# Altium schematic sheet lcd_breakout.SchDoc
size A
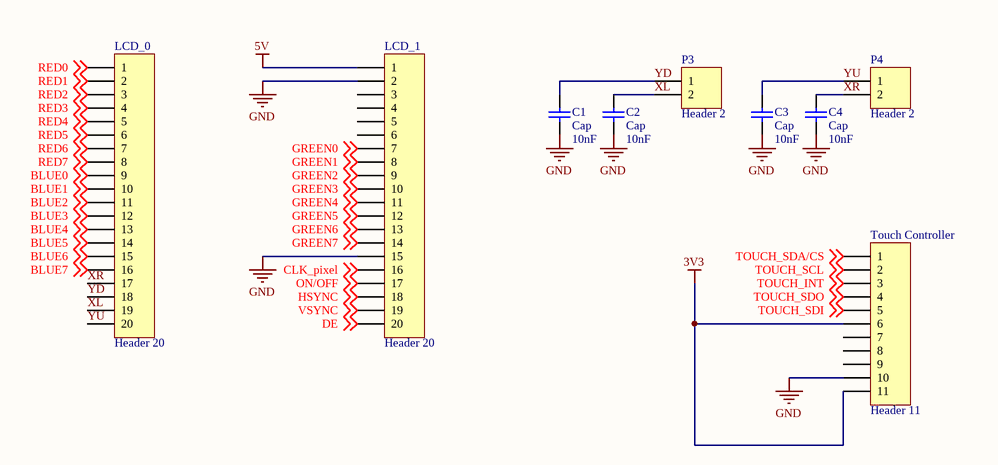
[diagram p0: lcd_breakout.SchDoc]

## Parts
C1  Cap  value 10nF  [6-0805_M]
C2  Cap  value 10nF  [6-0805_M]
C3  Cap  value 10nF  [6-0805_M]
C4  Cap  value 10nF  [6-0805_M]
LCD_0  Header 20  [HDR1X20]
LCD_1  Header 20  [HDR1X20]
P3  Header 2  [HDR1X2]
P4  Header 2  [HDR1X2]
Touch_Controller  Header 11  [HDR1X11]

## Nets
3V3: Touch_Controller.6 Touch_Controller.11
5V: LCD_1.1
GND: C1.1 C2.1 C3.1 C4.1 LCD_1.2 LCD_1.15 Touch_Controller.10
BLUE0: LCD_0.9 ; off-sheet BLUE0
BLUE1: LCD_0.10 ; off-sheet BLUE1
BLUE2: LCD_0.11 ; off-sheet BLUE2
BLUE3: LCD_0.12 ; off-sheet BLUE3
BLUE4: LCD_0.13 ; off-sheet BLUE4
BLUE5: LCD_0.14 ; off-sheet BLUE5
BLUE6: LCD_0.15 ; off-sheet BLUE6
BLUE7: LCD_0.16 ; off-sheet BLUE7
CLK_pixel: LCD_1.16 ; off-sheet CLK_pixel
DE: LCD_1.20 ; off-sheet DE
GREEN0: LCD_1.7 ; off-sheet GREEN0
GREEN1: LCD_1.8 ; off-sheet GREEN1
GREEN2: LCD_1.9 ; off-sheet GREEN2
GREEN3: LCD_1.10 ; off-sheet GREEN3
GREEN4: LCD_1.11 ; off-sheet GREEN4
GREEN5: LCD_1.12 ; off-sheet GREEN5
GREEN6: LCD_1.13 ; off-sheet GREEN6
GREEN7: LCD_1.14 ; off-sheet GREEN7
HSYNC: LCD_1.18 ; off-sheet HSYNC
ON/OFF: LCD_1.17 ; off-sheet ON/OFF
RED0: LCD_0.1 ; off-sheet RED0
RED1: LCD_0.2 ; off-sheet RED1
RED2: LCD_0.3 ; off-sheet RED2
RED3: LCD_0.4 ; off-sheet RED3
RED4: LCD_0.5 ; off-sheet RED4
RED5: LCD_0.6 ; off-sheet RED5
RED6: LCD_0.7 ; off-sheet RED6
RED7: LCD_0.8 ; off-sheet RED7
TOUCH_INT: Touch_Controller.3 ; off-sheet TOUCH_INT
TOUCH_SCL: Touch_Controller.2 ; off-sheet TOUCH_SCL
TOUCH_SDA/CS: Touch_Controller.1 ; off-sheet TOUCH_SDA/CS
TOUCH_SDI: Touch_Controller.5 ; off-sheet TOUCH_SDI
TOUCH_SDO: Touch_Controller.4 ; off-sheet TOUCH_SDO
VSYNC: LCD_1.19 ; off-sheet VSYNC
XL: C2.2 LCD_0.19 P3.2
XR: C4.2 LCD_0.17 P4.2
YD: C1.2 LCD_0.18 P3.1
YU: C3.2 LCD_0.20 P4.1

Not connected (* = marked no-connect by the designer): LCD_1 3 4 5 6; Touch_Controller 7 8 9

## Library data of the parts
C1-C4 = Cap: Capacitor; Published: 8-Jun-2000; LatestRevisionDate: 17-Jul-2002; LatestRevisionNote: Re-released for DXP Platform.; PackageReference: RAD-0.3; Publisher: Altium Limited; PackageDescription: Radial Cap, Thru-Hole; 2 Leads; 0.3 in Pin Spacing
LCD_0 LCD_1 = Header 20: Header, 20-Pin; LatestRevisionDate: 17-Jul-2002; LatestRevisionNote: Re-released for DXP Platform.; Publisher: Altium Limited
P3 P4 = Header 2: Header, 2-Pin; LatestRevisionDate: 17-Jul-2002; LatestRevisionNote: Re-released for DXP Platform.; Publisher: Altium Limited
Touch_Controller = Header 11: Header, 11-Pin; LatestRevisionDate: 17-Jul-2002; LatestRevisionNote: Re-released for DXP Platform.; Publisher: Altium Limited